# EAGLE design PPM2DSM MINI (EAGLE 6.6.0)
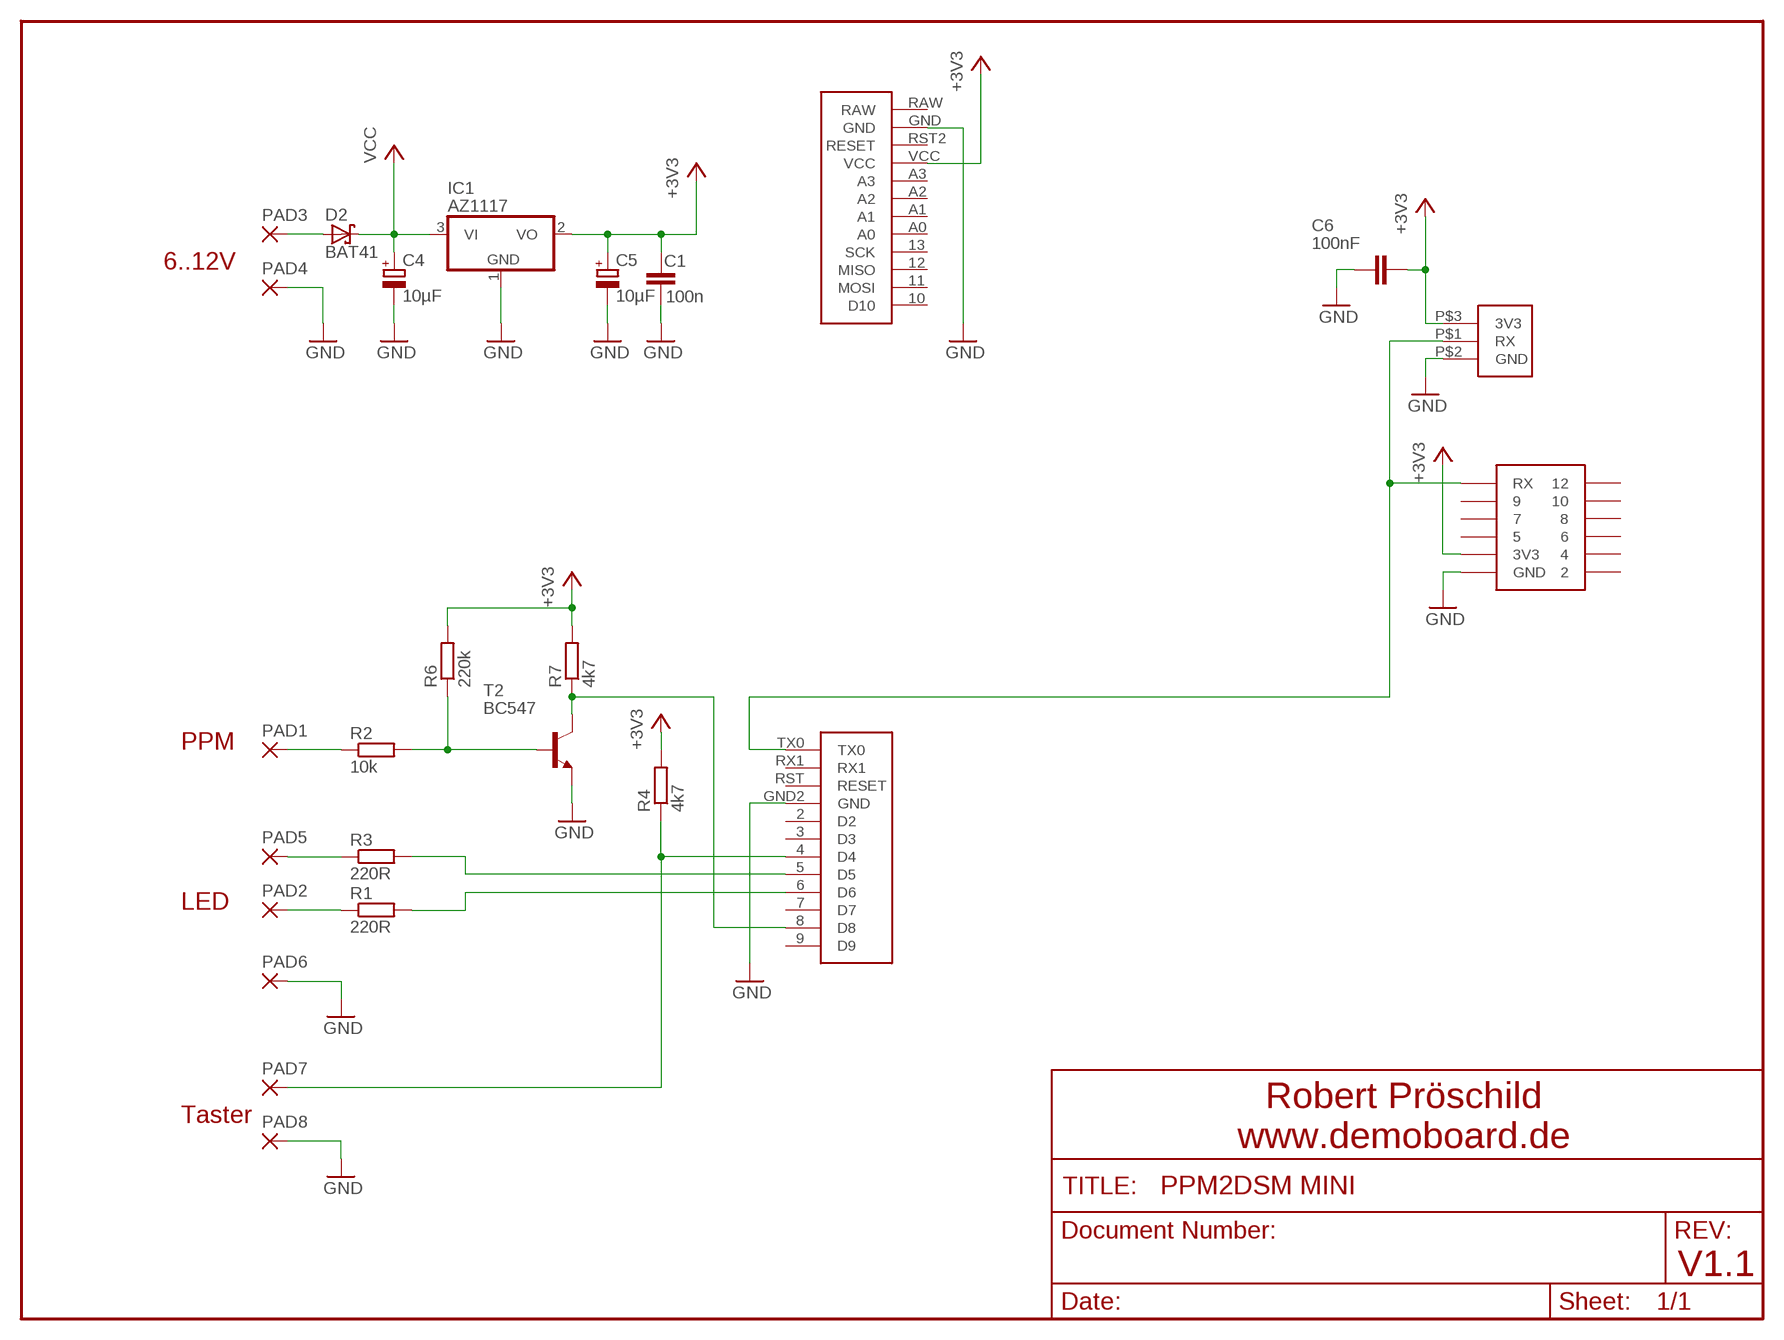
[diagram p0: schematic, sheet 1]

## Parts
C1  100n  C-EU025-024X044  [C025-024X044]
C4  10µF  CPOL-EUTT2D4  [TT2D4]
C5  10µF  CPOL-EUTT2D4  [TT2D4]
C6  100nF  C-EU025-024X044  [C025-024X044]
D2  BAT41  SCHOTTKY-DIODEDO35-7  [DO35-7]
IC1  AZ1117  [SOT223]
IC2  X10EMTX  [X10EMTX]
IC3  MINI_PRO  [PRO-MINI]
IC4  X1TX0  [X1TX0]
PAD1  SMD5  [SMD2,54-5,08]
PAD2  SMD5  [SMD2,54-5,08]
PAD3  SMD5  [SMD2,54-5,08]
PAD4  SMD5  [SMD2,54-5,08]
PAD5  SMD5  [SMD2,54-5,08]
PAD6  SMD5  [SMD2,54-5,08]
PAD7  SMD5  [SMD2,54-5,08]
PAD8  SMD5  [SMD2,54-5,08]
R1  220R  R-EU_0204/5  [0204/5]
R2  10k  R-EU_0204/5  [0204/5]
R3  220R  R-EU_0204/5  [0204/5]
R4  4k7  R-EU_0204/5  [0204/5]
R6  220k  R-EU_0204/5  [0204/5]
R7  4k7  R-EU_0204/5  [0204/5]
T2  BC547  [TO92]

## Nets
+3V3: C1.2 C5.+ C6.2 IC1.2(VO) IC2.P$3(3V3) IC3.VCC IC4.3(3V3) R4.2 R6.2 R7.2
D4: IC3.4(D4) PAD7.1(P) R4.1
D5: IC3.5(D5) R3.2
D6: IC3.6(D6) R1.2
D8: IC3.8(D8) R7.1 T2.3(C)
GND [vcc]: C1.1 C4.- C5.- C6.1 IC1.1(GND) IC2.P$2(GND) IC3.GND IC3.GND2(GND) IC4.1(GND) PAD4.1(P) PAD6.1(P) PAD8.1(P) T2.1(E)
N$3: D2.A PAD3.1(P)
N$5: R2.2 R6.1 T2.2(B)
N$6: PAD1.1(P) R2.1
N$7: PAD2.1(P) R1.1
N$38: PAD5.1(P) R3.1
TXO: IC2.P$1(RX) IC3.TX0 IC4.11(RX)
VCC: C4.+ D2.C IC1.3(VI)
Unconnected: IC3.2(D2) IC3.3(D3) IC3.7(D7) IC3.9(D9) IC3.10(D10) IC3.11(MOSI) IC3.12(MISO) IC3.13(SCK) IC3.A0 IC3.A1 IC3.A2 IC3.A3 IC3.RST2(RESET) IC3.RST(RESET) IC3.RX1 IC4.5 IC4.6 IC4.7 IC4.8 IC4.9 IC4.10 IC4.12

## Notes on the sheet
- 6..12V
- PPM
- LED
- Taster
- Robert Pröschild
  www.demoboard.de
- V1.1

## Power pins joined to a net without a drawn wire
2: IC4.2
4: IC4.4
A4: IC3.A4
A5: IC3.A5
RAW: IC3.RAW

## Library data of the parts
C1 C6 = rcl:C-EU: CAPACITOR, European symbol
C4 C5 = rcl:CPOL-EU: POLARIZED CAPACITOR, European symbol
D2 = diode:SCHOTTKY-DIODE: Schottky Diode
IC1 = linear:AZ1117
IC2 = Spektrum:X10EMTX
IC3 = Arduino:MINI_PRO
IC4 = Spektrum:X1TX0
PAD1-PAD8 = wirepad:SMD5: SMD PAD
R1-R4 R6 R7 = rcl:R-EU_: RESISTOR, European symbol
T2 = transistor:BC547: NPN TRANSISTOR

## Net classes
0 default: width 0.203 mm
1 vcc: width 0.254 mm

## Board
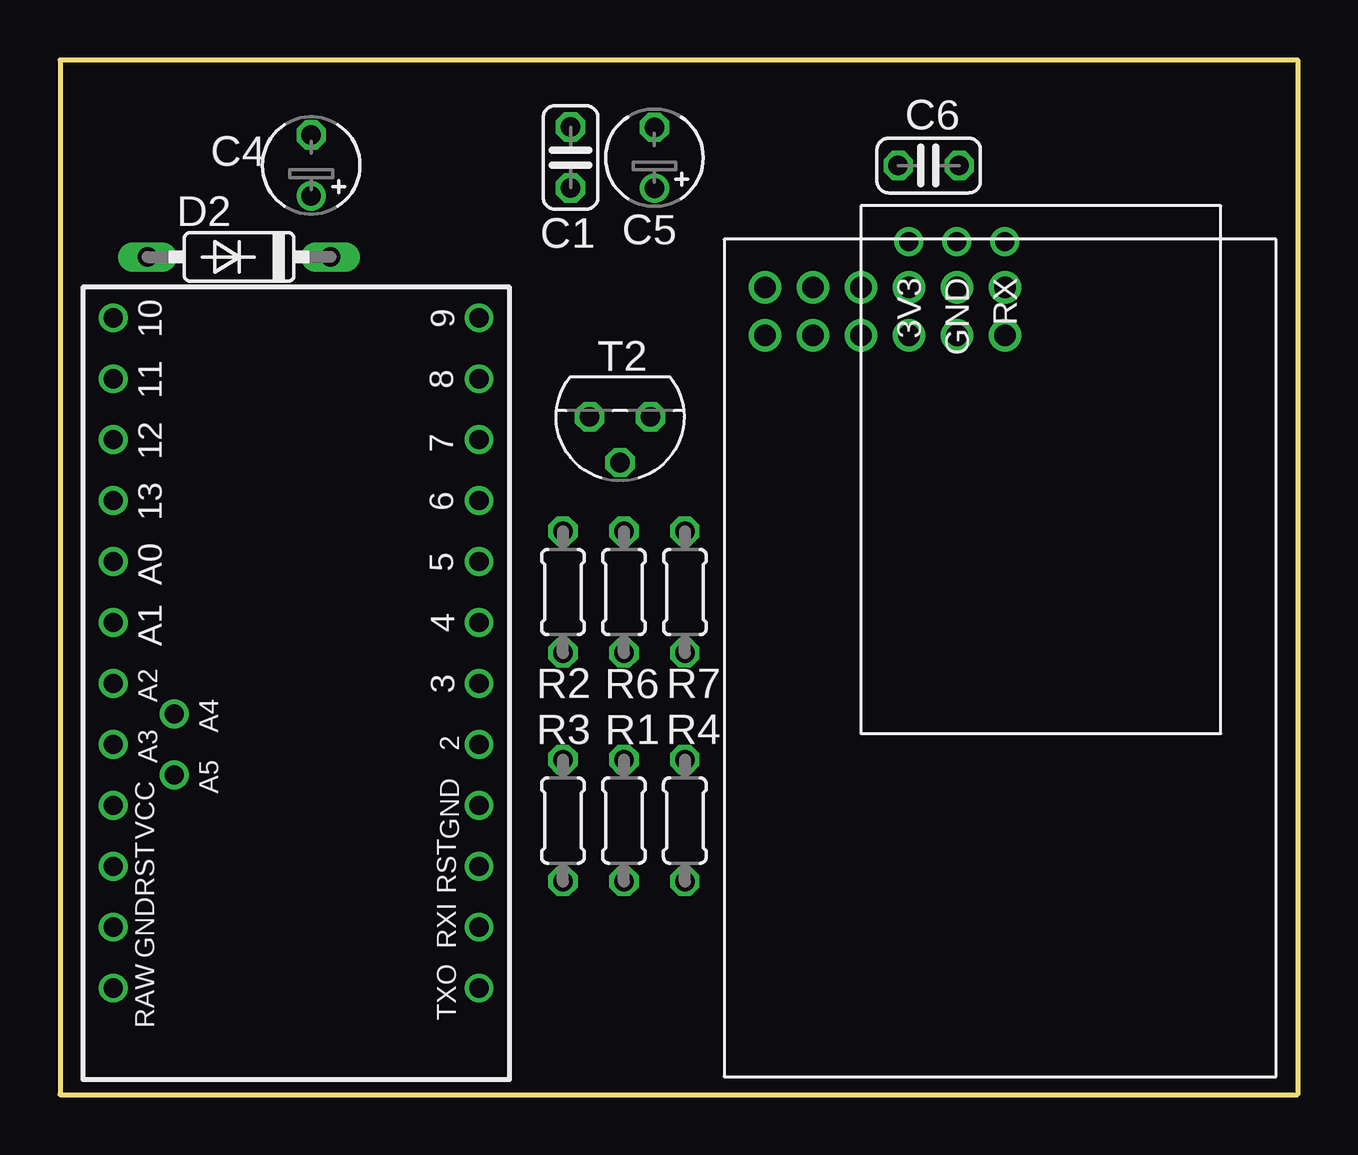
[diagram p1: board, top side]
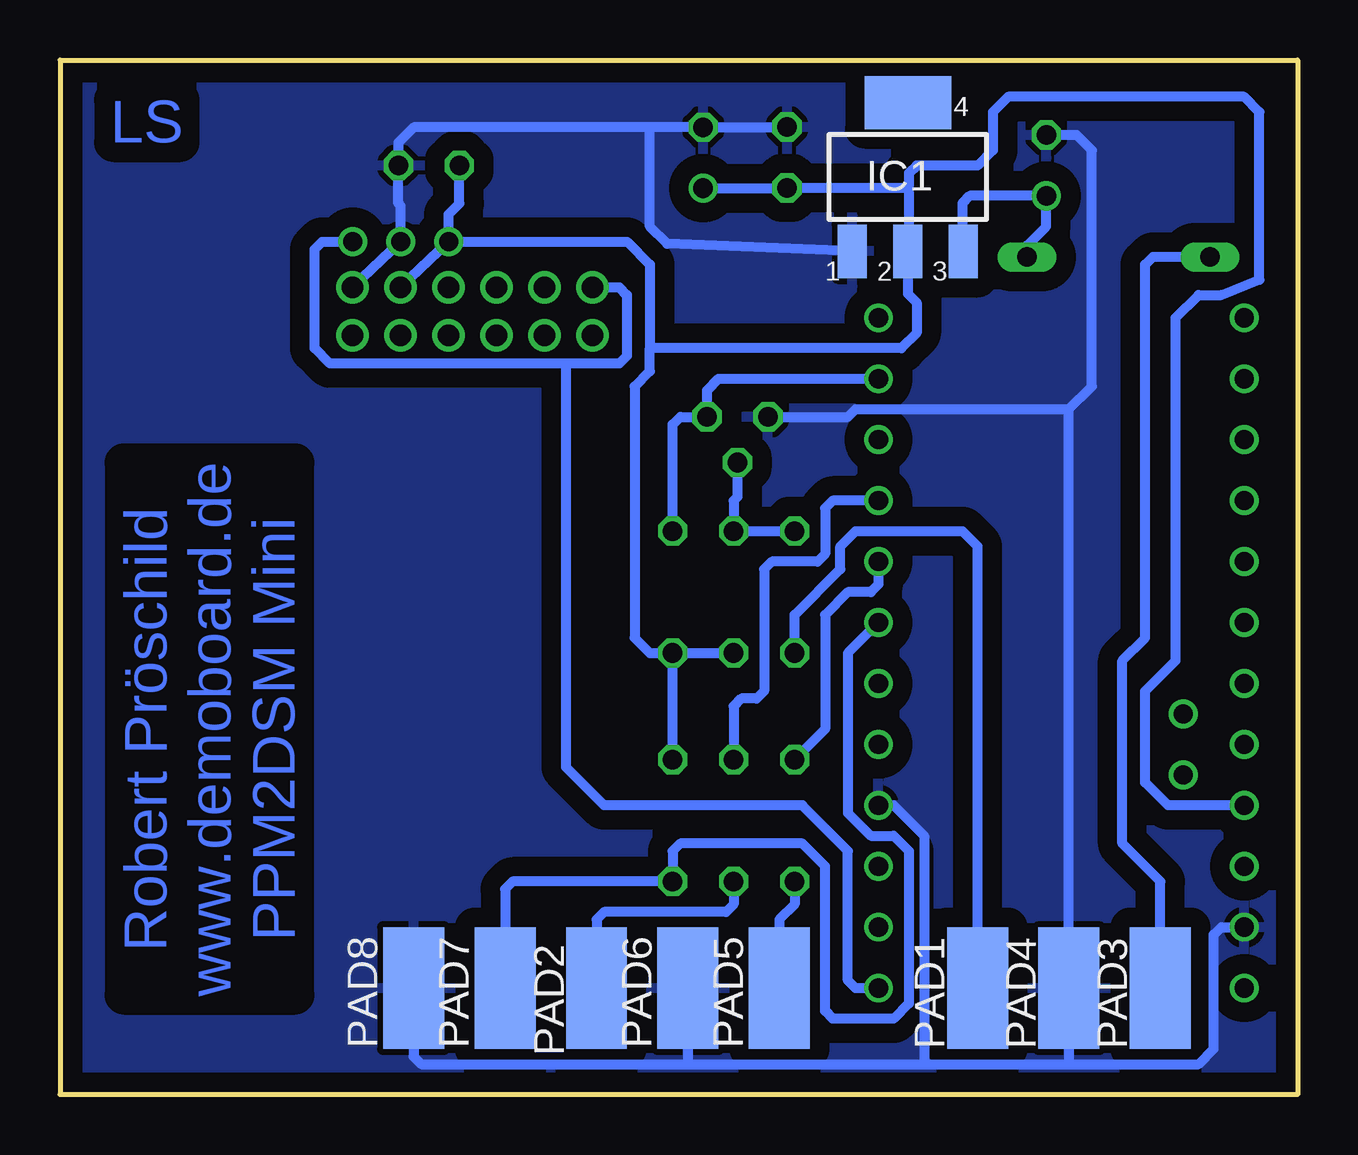
[diagram p2: board, bottom side, seen from below]

Size 51.56 x 43.13 mm. Coordinates in mm from the lower left corner, seen from the top.
Outline: 0,43.13 0,0 51.56,0 51.56,43.13 0,43.13
Copper layers (1*16): Top 0.035mm / dielectric 1.6mm / Bottom 0.035mm
Design rules "Elecrow_2-layer_PCB_eagle_rule": minimum track width 6mil, minimum drill 12mil, track to track 6mil, track to pad 6mil, pad to pad 6mil, via to via 8mil, smd to smd 0mil, copper to edge 20mil, drill to drill 10mil, minimum pad ring 6mil, minimum via ring 6mil, stop-mask expansion 0mil, vias tented up to drill 100mil, thermal gap 10mil

### Footprints (pad centres in the part's own frame; a part is rotated, then mirrored left to right if it is on the bottom)
C025-024X044 = drill 0.813 octagon: 1 -1.27,0; 2 1.27,0
TT2D4 = drill 0.813: + -1.27,0 | drill 0.813 octagon: - 1.27,0
DO35-7 = drill 0.813 long: A 3.81,0; C -3.81,0
SOT223 = smd 1.219 x 2.235: 1 -2.311,-3.099; 2 0,-3.099; 3 2.311,-3.099 | smd 3.6 x 2.2: 4 0,3.099
X10EMTX = drill 0.8: P$1 0,0; P$2 2,0; P$3 4,0
PRO-MINI = drill 0.8: 2 -7.62,5.08; 3 -7.62,2.54; 4 -7.62,0; 5 -7.62,-2.54; 6 -7.62,-5.08; 7 -7.62,-7.62; 8 -7.62,-10.16; 9 -7.62,-12.7; 10 7.62,-12.7; 11 7.62,-10.16; 12 7.62,-7.62; 13 7.62,-5.08; A0 7.62,-2.54; A1 7.62,0; A2 7.62,2.54; A3 7.62,5.08; A4 5.08,3.81; A5 5.08,6.35; GND -7.62,7.62; GND2 7.62,12.7; RAW 7.62,15.24; RST -7.62,10.16; RST2 7.62,10.16; RX1 -7.62,12.7; TX0 -7.62,15.24; VCC 7.62,7.62
X1TX0 = drill 0.9: 1 0,0; 2 0,2; 3 2,0; 4 2,2; 5 4,0; 6 4,2; 7 6,0; 8 6,2; 9 8,0; 10 8,2; 11 10,0; 12 10,2
SMD2,54-5,08 = smd 2.54 x 5.08: 1 0,0
0204/5 = drill 0.813 octagon: 1 -2.54,0; 2 2.54,0
TO92 = drill 0.813 octagon: 1 1.27,0; 2 0,1.905; 3 -1.27,0

### Placement (x,y rotation side)
C1  21.27,39.07 270 top
C4  10.47,38.74 90 top
C5  24.77,39.06 90 top
C6  36.19,38.73 180 top
D2  7.46,34.92 180 top
IC1  16.24,38.26 0 bottom
IC2  39.37,35.56 180 top
IC3  9.84,19.68 180 top
IC4  39.37,33.66 180 top
PAD1  13.34,4.45 0 bottom
PAD2  29.21,4.45 0 bottom
PAD3  5.71,4.45 0 bottom
PAD4  9.53,4.45 0 bottom
PAD5  21.59,4.45 0 bottom
PAD6  25.4,4.45 0 bottom
PAD7  33.02,4.45 0 bottom
PAD8  36.83,4.45 0 bottom
R1  23.5,11.43 90 top
R2  20.95,20.95 90 top
R3  20.95,11.43 90 top
R4  26.03,11.43 90 top
R6  23.5,20.95 270 top
R7  26.04,20.95 270 top
T2  23.34,28.26 180 top

### Tracks (layer width: path | path; a pad name or v marks a point on that pad's centre or on a via)
+3V3
  Bottom 0.406: C5.+ 21.28,37.79 C1.2 16.21,37.8 | 16.21,37.8 16.19,37.47 16.19,35.52 IC1.2 16.24,33.38 15.88,33.02 15.88,31.75 16.51,31.11 26.99,31.11 | IC4.3 IC2.P$3 | IC2.P$3 35.37,36.7 34.92,37.15 C6.2 | C6.2 | R4.2 R7.2 | R7.2 | R7.2 R6.2 | R7.2 26.99,18.41 27.62,19.05 27.62,29.53 26.99,30.16 26.99,31.11 | IC2.P$3 27.94,35.56 26.99,34.61 26.99,31.11 | IC3.VCC 5.4,12.06 6.35,13.02 6.35,16.83 5.08,18.1 5.08,32.38 4.13,33.34 3.17,33.34 1.59,33.97 1.59,40.96 2.22,41.59 12.06,41.59 12.7,40.96 12.7,39.37 13.34,38.73 15.88,38.73 16.19,38.42 16.19,37.82 16.21,37.8
D4
  Bottom 0.406: R4.1 32.7,8.89 33.02,8.57 PAD7.1 | IC3.4 18.73,18.41 18.73,11.75 17.78,10.79 16.83,10.79 16.19,10.16 16.19,3.81 16.83,3.17 19.37,3.17 19.68,3.49 19.68,9.53 20.64,10.48 25.72,10.48 26.04,10.16 R4.1 | R4.1
D5
  Bottom 0.406: R3.2 19.68,15.24 19.68,20 18.73,20.95 17.78,20.95 17.46,21.27 IC3.5
D6
  Bottom 0.406: IC3.6 19.37,24.77 19.68,24.45 19.68,22.54 20,22.23 21.91,22.23 22.23,21.91 22.23,16.83 22.54,16.51 23.18,16.51 23.5,16.19 R1.2
D8
  Bottom 0.406: R7.1 26.04,27.94 25.72,28.26 T2.3 24.61,29.37 24.13,29.84 IC3.8
GND
  Bottom 0.406: C1.1 21.28,40.33 C5.- 26.99,40.33 | IC4.1 IC2.P$2 37.37,37.05 37.47,37.15 C6.1 | C6.1 | 25.4,1.27 36.51,1.27 36.83,1.59 PAD8.1 36.51,4.76 | 25.4,1.27 15.56,1.27 | 15.56,1.27 9.53,1.27 | 9.53,1.27 4.13,1.27 3.49,1.91 3.49,6.67 3.17,6.99 IC3.GND2 | 9.53,1.27 PAD4.1 9.53,28.57 | PAD6.1 25.4,1.27 | 26.99,40.33 36.82,40.33 37.47,39.69 C6.1 | IC1.1 26.27,35.48 26.99,36.2 26.99,40.33 | 9.53,28.57 8.57,29.53 8.57,39.37 9.21,40.01 C4.- | IC3.GND 16.83,12.06 15.56,10.79 15.56,1.27 | T2.1 18.73,28.26 18.41,28.57 9.53,28.57
  pour Bottom (isolate 0.813): 0.64,0.64 0.64,42.23 50.8,42.23 50.8,0.64
N$3
  Bottom 0.406: PAD3.1 5.71,8.89 7.3,10.48 7.3,18.1 6.35,19.05 6.35,34.61 6.03,34.92 D2.A
N$5
  Bottom 0.406: T2.2 23.34,24.92 23.5,24.77 R6.1 R2.2
N$6
  Bottom 0.406: R2.1 20.95,20 19.05,21.91 19.05,22.86 18.41,23.5 13.97,23.5 13.34,22.86 PAD1.1
N$7
  Bottom 0.406: R1.1 23.5,7.94 23.81,7.62 28.89,7.62 29.21,7.3 PAD2.1
N$38
  Bottom 0.406: R3.1 20.95,7.94 21.59,7.3 PAD5.1
TXO
  Bottom 0.406: IC3.TX0 18.41,4.45 18.73,4.76 18.73,10.16 20.64,12.06 28.89,12.06 30.48,13.65 30.48,30.48 | IC4.11 28.26,33.66 27.94,33.34 27.94,30.8 28.26,30.48 30.48,30.48 | 30.48,30.48 40.32,30.48 40.96,31.11 40.96,35.24 40.64,35.56 IC2.P$1 | IC2.P$1
VCC
  Bottom 0.406: D2.C 11.27,35.4 10.48,36.2 10.48,37.46 C4.+ 13.65,37.47 13.97,37.15 13.97,35.52 IC1.3

### Text on the board
Bottom: LS | Robert Pröschild / www.demoboard.de / PPM2DSM Mini
tValues: Tent Vias! | Arduino Wee v1.3
Document: Copyright by / Robert Pröschild / proeschild@gmx.de / www.demoboard.de / only for private use